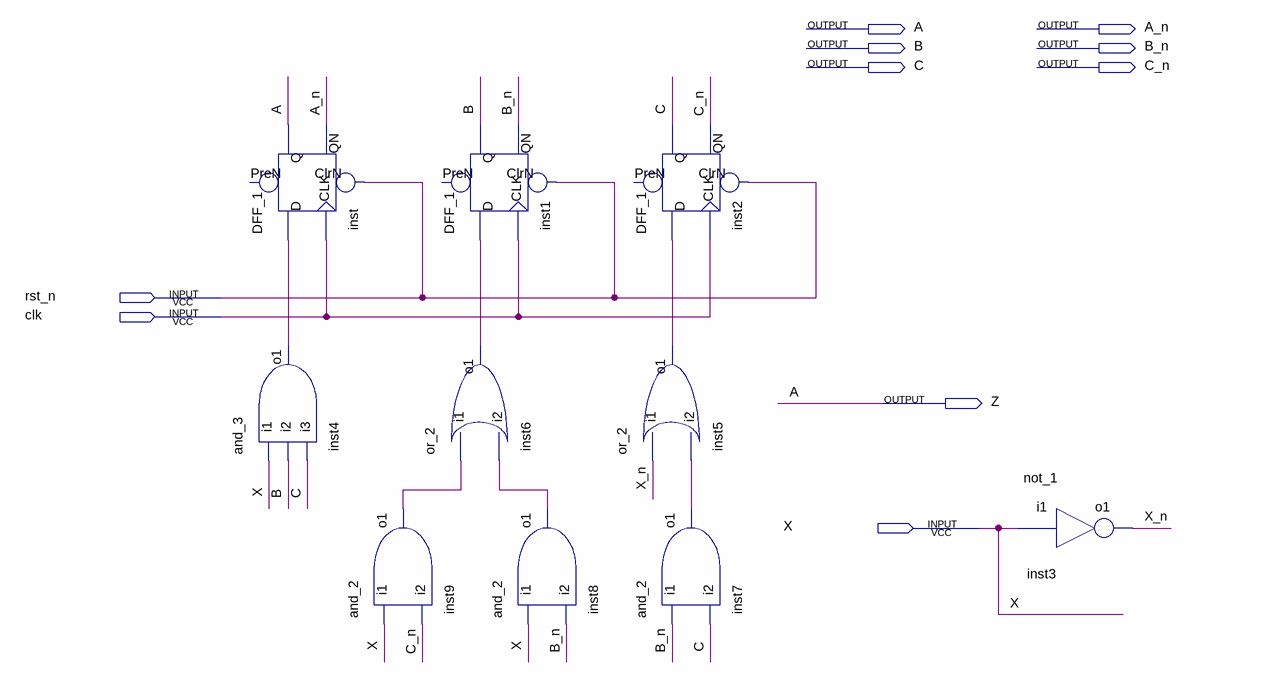
[diagram p0: schematic sheet]
// Quartus schematic 011Detector.bdf as structural Verilog: 10 symbols, 10 pins
module \011Detector  (
  input  rst_n,
  input  clk,
  input  X,
  output A,
  output A_n,
  output B,
  output B_n,
  output C,
  output C_n,
  output Z
);

  wire inst4_o1, inst5_o1, inst6_o1, inst7_o1, inst8_o1, inst9_o1, X_n;

  and_3 inst4 (.i1(X), .i2(B), .i3(C), .o1(inst4_o1));
  DFF_1 inst (.CLK(clk), .D(inst4_o1), .ClrN(rst_n), .QN(A_n), .Q(A));  // open: PreN
  and_2 inst9 (.i1(X), .i2(C_n), .o1(inst9_o1));
  DFF_1 inst1 (.CLK(clk), .D(inst6_o1), .ClrN(rst_n), .QN(B_n), .Q(B));  // open: PreN
  or_2 inst6 (.i1(inst9_o1), .i2(inst8_o1), .o1(inst6_o1));
  and_2 inst8 (.i1(X), .i2(B_n), .o1(inst8_o1));
  or_2 inst5 (.i1(X_n), .i2(inst7_o1), .o1(inst5_o1));
  DFF_1 inst2 (.CLK(clk), .D(inst5_o1), .ClrN(rst_n), .QN(C_n), .Q(C));  // open: PreN
  and_2 inst7 (.i1(B_n), .i2(C), .o1(inst7_o1));
  not_1 inst3 (.i1(X), .o1(X_n));

  assign Z = A;
endmodule
